# EAGLE design ATtinyBoard_capBall (EAGLE 6.4)
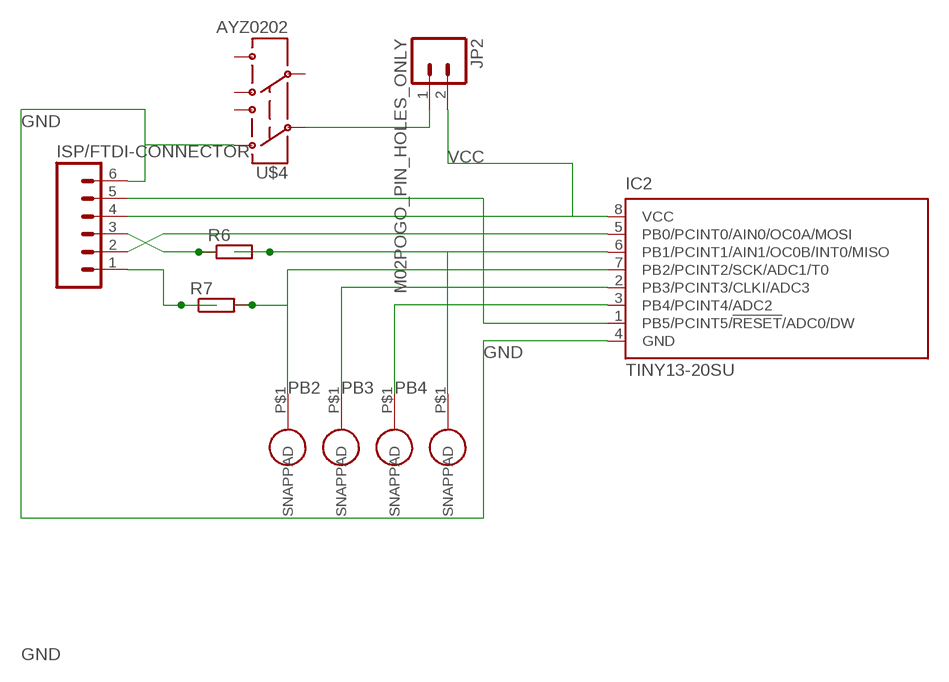
[diagram p0: schematic, sheet 1]

## Parts
IC2  TINY13-20SU  [8S2]
ISP/FTDI-CONNECTOR  M06SMD  [1X06-SMD]
JP2  M02POGO_PIN_HOLES_ONLY  [1X02_PP_HOLES_ONLY]
R6  R-EU_R2012  [R2012]
R7  R-EU_R2012  [R2012]
U$1  SNAP-PAD_7MM_ROUND  [SNAP-PAD_7MM_RD]
U$2  SNAP-PAD_7MM_ROUND  [SNAP-PAD_7MM_RD]
U$3  SNAP-PAD_7MM_ROUND  [SNAP-PAD_7MM_RD]
U$4  AYZ0202  [AYZ0202]
U$6  SNAP-PAD_7MM_ROUND  [SNAP-PAD_7MM_RD]

## Nets
GND: IC2.4(GND) ISP/FTDI-CONNECTOR.6 U$4.3
N$1: IC2.5(PB0/PCINT0/AIN0/OC0A/MOSI) ISP/FTDI-CONNECTOR.2
N$2: ISP/FTDI-CONNECTOR.3 R6.1
N$3: IC2.1(PB5/PCINT5/!RESET!/ADC0/DW) ISP/FTDI-CONNECTOR.5
N$4: IC2.6(PB1/PCINT1/AIN1/OC0B/INT0/MISO) R6.2 U$6.P$1(SNAPPAD)
N$5: ISP/FTDI-CONNECTOR.1 R7.1
N$7: JP2.1 U$4.2
PB2: IC2.7(PB2/PCINT2/SCK/ADC1/T0) R7.2 U$1.P$1(SNAPPAD)
PB3: IC2.2(PB3/PCINT3/CLKI/ADC3) U$2.P$1(SNAPPAD)
PB4: IC2.3(PB4/PCINT4/ADC2) U$3.P$1(SNAPPAD)
VCC: IC2.8(VCC) ISP/FTDI-CONNECTOR.4 JP2.2
Unconnected: U$4.1 U$4.4 U$4.5 U$4.6

## Library data of the parts
IC2 = atmel:TINY13: 8-bit AVR Microcontroller with 1K Bytes In-System Programmable Flash Source: http://www.atmel.com/dyn/resources/prod_documents/2535S.pdf; MPN: ATTINY13-20SU; OC_FARNELL: 9171568; OC_NEWARK: 96K6522
ISP/FTDI-CONNECTOR = SparkFun-Connectors:M06: Header 6 Standard 6-pin 0.1" header. Use with straight break away headers (SKU : PRT-00116), right angle break away headers (PRT-00553), swiss pins (PRT-00743), machine pins (PRT-00117), and female headers (PRT-00115). Molex polarized connector foot print use with SKU : PRT-08094 with associated crimp pins and housings. NOTES ON THE VARIANTS LOCK and LOCK_LONGPADS... This footprint was designed to help hold the alignment of a through-hole component (i.e. 6-pin header) while soldering it into place. You may notice that each hole has been shifted either up or down by 0.005 of an inch from it's more standard position (which is a perfectly straight line). This slight alteration caused the pins (the squares in the middle) to touch the edges of the holes. Because they are alternating, it causes a "brace" to hold the component in place. 0.005 has proven to be the perfect amount of "off-center" position when using our standard breakaway headers. Although looks a little odd when you look at the bare footprint, once you have a header in there, the alteration is very hard to notice. Also,if you push a header all the way into place, it is covered up entirely on the bottom side. This idea of altering the position of holes to aid alignment will be further integrated into the Sparkfun Library for other footprints. It can help hold any component with 3 or more connection pins.
JP2 = SparkFun-Connectors:M02: Standard 2-pin 0.1" header. Use with - straight break away headers ( PRT-00116) - right angle break away headers (PRT-00553) - swiss pins (PRT-00743) - machine pins (PRT-00117) - female headers (PRT-00115) Molex polarized connector foot print use with: PRT-08233 with associated crimp pins and housings. 2.54_SCREWTERM for use with PRT-10571. 3.5mm Screw Terminal footprints for PRT-08084 5mm Screw Terminal footprints for use with PRT-08433
R6 R7 = resistor:R-EU_: RESISTOR, European symbol
U$1-U$3 U$6 = hannahsEagleLib:SNAP-PAD_7MM_ROUND
U$4 = SparkFun-Electromechanical:AYZ0202: SPDT Slide Switch Simple SMD single-pull double-throw slide switch. Good for less than 350mA power switch, switching UARTs between devices, etc. Spark Fun Electronics SKU : COM-00597

## Board
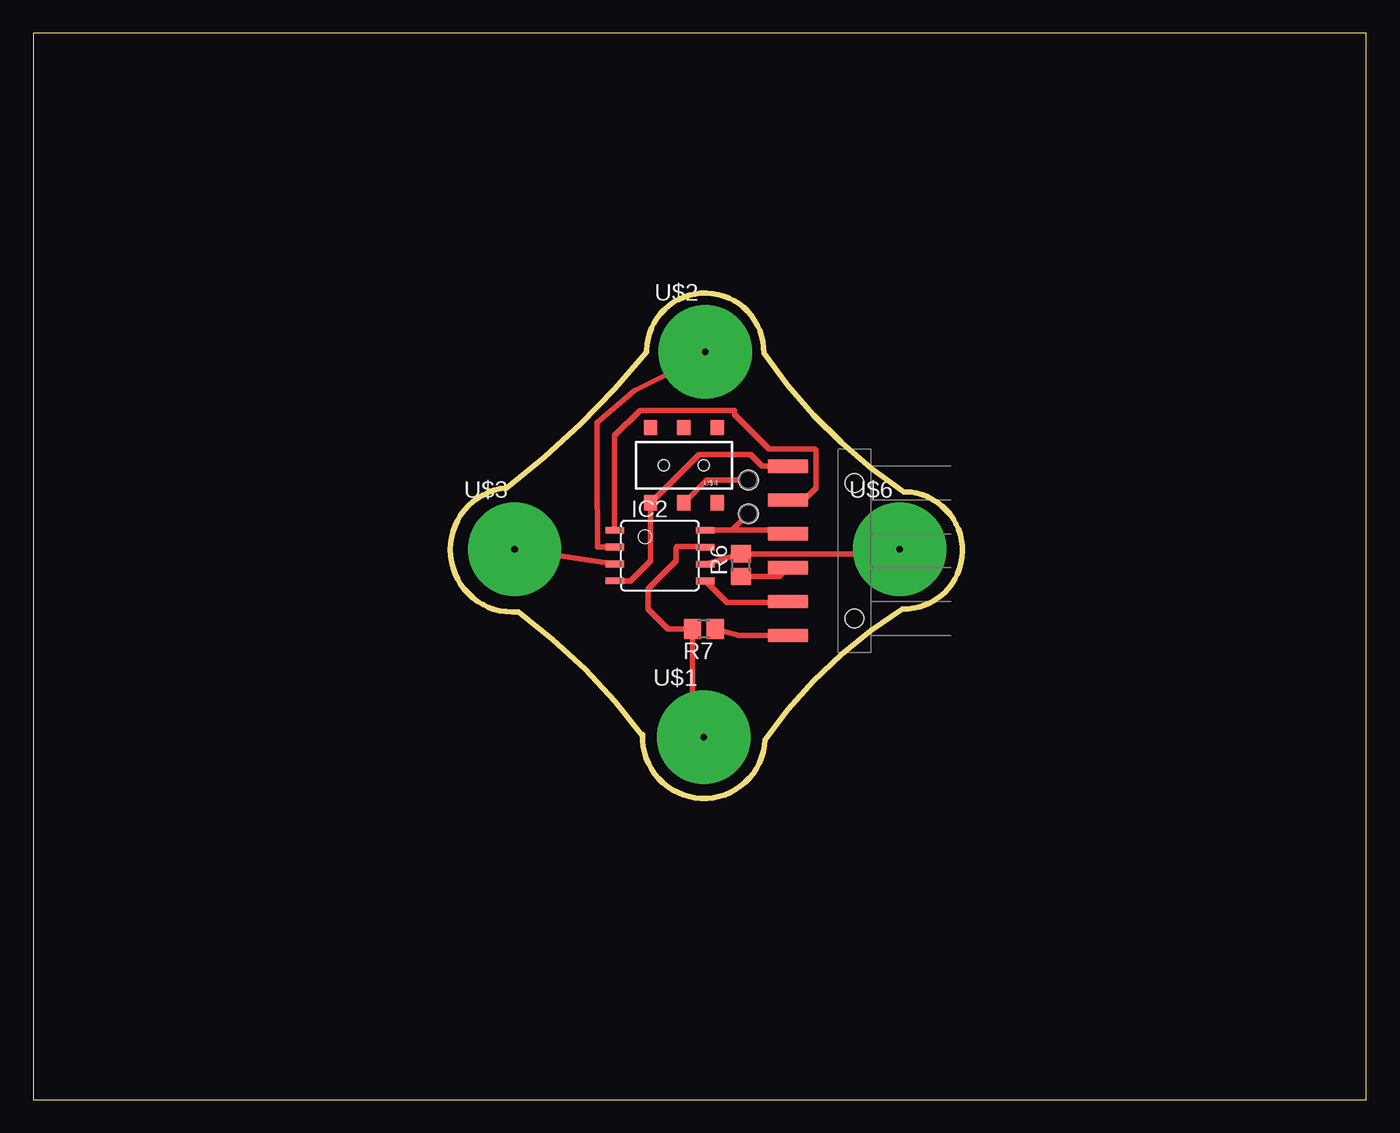
[diagram p1: board, top side]

Size 100 x 80 mm. Coordinates in mm from the lower left corner, seen from the top.
Outline: 0,0 100,0 100,80 0,80 0,0
Copper layers (1*16): Top 0.035mm / dielectric 1.5mm / Bottom 0.035mm
Design rules "default": minimum track width 10mil, minimum drill 24mil, track to track 8mil, track to pad 8mil, pad to pad 8mil, via to via 8mil, smd to smd 8mil, copper to edge 40mil, drill to drill 8mil, minimum pad ring 10mil, minimum via ring 8mil, stop-mask expansion 4mil, vias tented up to drill 0mil, thermal gap 10mil
Milling: 8 lines

### Footprints (pad centres in the part's own frame; a part is rotated, then mirrored left to right if it is on the bottom)
8S2 = smd 0.5 x 1.4: 1 -1.905,-3.404; 2 -0.645,-3.404; 3 0.625,-3.404; 4 1.895,-3.404; 5 1.905,3.404; 6 0.635,3.404; 7 -0.635,3.404; 8 -1.905,3.404
1X06-SMD = smd 1 x 3: 1 -6.35,5; 2 -3.81,5; 3 -1.27,5; 4 1.27,5; 5 3.81,5; 6 6.35,5 | hole 1.4: -5.08,0; 5.08,0
1X02_PP_HOLES_ONLY = drill 0.889 pad 0.813: 1 0,0; 2 2.54,0 | hole 1.473: 0,0; 2.54,0
R2012 = smd 1.3 x 1.5: 1 -0.85,0; 2 0.85,0
SNAP-PAD_7MM_RD = drill 0.5 pad 7: P$1 0,0
AYZ0202 = smd 1 x 1.15: 1 -2.5,2.825; 2 0,2.825; 3 2.5,2.825; 4 -2.5,-2.825; 5 0,-2.825; 6 2.5,-2.825 | hole 0.85: 1.5,0; -1.5,0

### Placement (x,y rotation side)
IC2  47.02,40.81 270 top
ISP/FTDI-CONNECTOR  61.6,41.17 90 top
JP2  53.64,46.49 270 top
R6  53.1,40.1 90 top
R7  50.3,35.3 180 top
U$1  50.3,27.2 0 top
U$2  50.4,56.1 0 top
U$3  36.1,41.3 0 top
U$4  48.8,47.6 180 top
U$6  65,41.3 0 top

### Tracks (layer width: path | path; a pad name or v marks a point on that pad's centre or on a via)
GND
  Top 0.406: IC2.4 44.81,38.91 46.3,40.4 U$4.3 49.92,48.4 53.8,48.4 54.67,47.52 ISP/FTDI-CONNECTOR.6
N$1
  Top 0.406: IC2.5 52.03,37.3 56.53,37.3 arc90 ISP/FTDI-CONNECTOR.2
N$2
  Top 0.406: R6.1 55.95,39.25 ISP/FTDI-CONNECTOR.3
N$3
  Top 0.406: IC2.1 43.62,49.82 45.5,51.7 52.6,51.7 52.6,51.4 55.2,48.8 58.6,48.8 58.7,48.7 58.7,45.9 57.8,45 56.62,45 ISP/FTDI-CONNECTOR.5
N$4
  Top 0.406: IC2.6 R6.2 64.65,40.95 U$6.P$1
N$5
  Top 0.406: R7.1 52.92,34.83 ISP/FTDI-CONNECTOR.1
N$7
  Top 0.406: U$4.2 50.52,46.49 JP2.1
PB2
  Top 0.406: IC2.7 50.37,41.5 48.3,41.5 48.2,41.4 48.2,40.4 46.1,38.3 46.1,36.8 47.6,35.3 R7.2 49.45,29.25 U$1.P$1
PB3
  Top 0.406: IC2.2 42.34,41.45 42.3,47.1 42.3,50.8 45.1,53.2 49.9,55.6 U$2.P$1
PB4
  Top 0.406: IC2.3 43.6,40.2 U$3.P$1
VCC
  Top 0.406: IC2.8 52.2,42.72 52.41,42.72 | 52.41,42.72 55.23,42.72 ISP/FTDI-CONNECTOR.4 | JP2.2 52.41,42.72